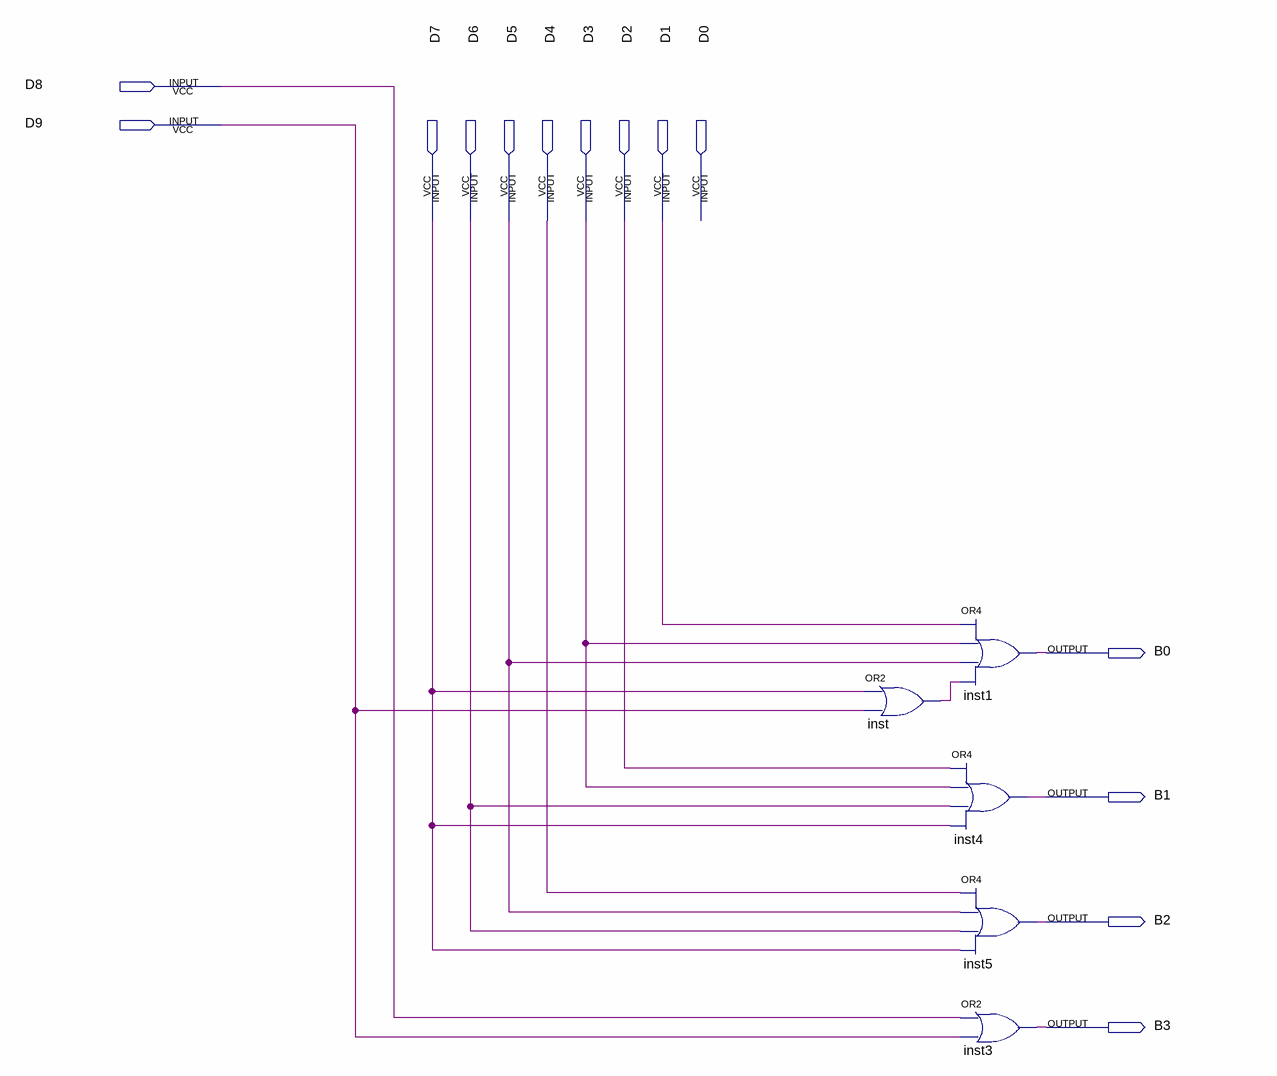
[diagram p0: schematic sheet]
// Quartus schematic Coder.bdf as structural Verilog: 5 symbols, 14 pins
module Coder (
  input  D8,
  input  D9,
  input  D7,
  input  D6,
  input  D5,
  input  D4,
  input  D3,
  input  D2,
  input  D1,
  input  D0,
  output B0,
  output B1,
  output B2,
  output B3
);

  wire inst_out;

  or inst (inst_out, D7, D9);
  or inst1 (B0, D1, D3, D5, inst_out);
  or inst4 (B1, D2, D3, D6, D7);
  or inst5 (B2, D4, D5, D6, D7);
  or inst3 (B3, D8, D9);
endmodule
